# Altium schematic sheet AFE.SchDoc
size A; SheetNumber: 7; SheetTotal: 12
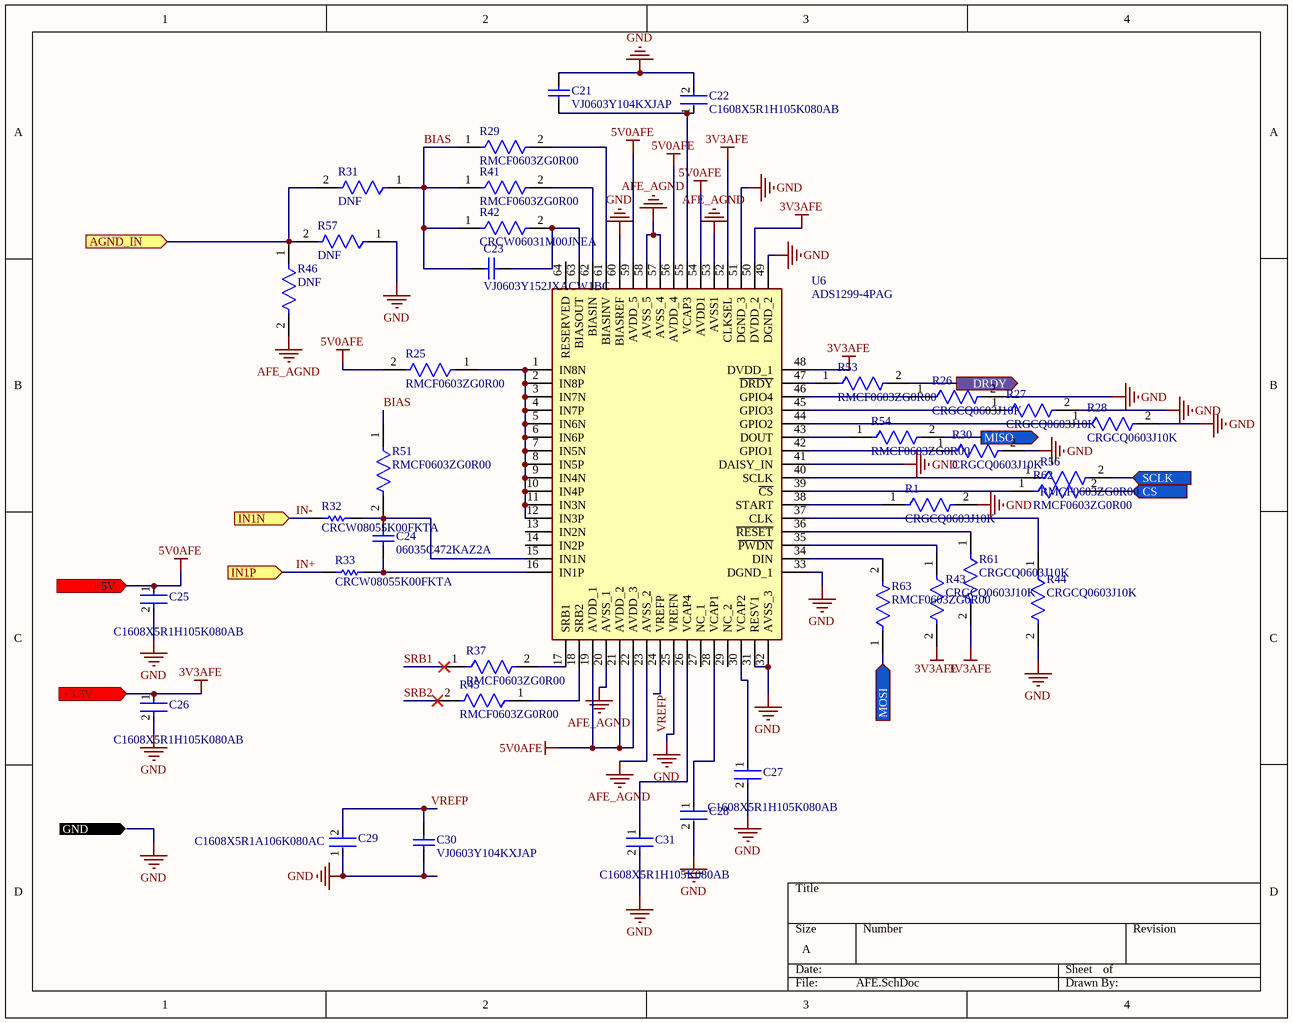
[diagram p0: AFE.SchDoc]

## Parts
C21  VJ0603Y104KXJAP  [CAPC1608X92X38NL15T08]
C22  C1608X5R1H105K080AB  [FP-C1608-080-0_1-IPC_B]
C23  VJ0603Y152JXACW1BC  [CAPC1608X95X40NL15T15]
C24  06035C472KAZ2A  [CAPC1608X90X35LL15T15]
C25  C1608X5R1H105K080AB  [FP-C1608-080-0_1-IPC_B]
C26  C1608X5R1H105K080AB  [FP-C1608-080-0_1-IPC_B]
C27  C1608X5R1H105K080AB  [FP-C1608-080-0_1-IPC_B]
C28  GRM21BR60J107ME15K  [FP-GRM21B-0_2-e0_2_0_7-IPC_B]  (value not drawn)
C29  C1608X5R1A106K080AC  [FP-C1608-080-0_1-MFG]
C30  VJ0603Y104KXJAP  [CAPC1608X92X38NL15T08]
C31  C1608X5R1H105K080AB  [FP-C1608-080-0_1-IPC_B]
R1  CRGCQ0603J10K  [FP-CRGCQ0603-IPC_C]
R25  RMCF0603ZG0R00  [FP-RMCF0603-IPC_B]
R26  CRGCQ0603J10K  [FP-CRGCQ0603-IPC_C]
R27  CRGCQ0603J10K  [FP-CRGCQ0603-IPC_C]
R28  CRGCQ0603J10K  [FP-CRGCQ0603-IPC_C]
R29  RMCF0603ZG0R00  [FP-RMCF0603-IPC_B]
R30  CRGCQ0603J10K  [FP-CRGCQ0603-IPC_C]
R31  DNF  [FP-RMCF0603-IPC_B]
R32  CRCW08055K00FKTA  [RESC2013X50X30ML20T20]
R33  CRCW08055K00FKTA  [RESC2013X50X30ML20T20]
R37  RMCF0603ZG0R00  [FP-RMCF0603-IPC_B]
R41  RMCF0603ZG0R00  [FP-RMCF0603-IPC_B]
R42  CRCW06031M00JNEA  [FP-CRCW0603-e3-IPC_B]
R43  CRGCQ0603J10K  [FP-CRGCQ0603-IPC_C]
R44  CRGCQ0603J10K  [FP-CRGCQ0603-IPC_C]
R45  RMCF0603ZG0R00  [FP-RMCF0603-IPC_B]
R46  DNF  [FP-RMCF0603-IPC_B]
R51  RMCF0603ZG0R00  [FP-RMCF0603-IPC_B]
R53  RMCF0603ZG0R00  [FP-RMCF0603-IPC_B]
R54  RMCF0603ZG0R00  [FP-RMCF0603-IPC_B]
R56  RMCF0603ZG0R00  [FP-RMCF0603-IPC_B]
R57  DNF  [FP-RMCF0603-IPC_B]
R61  CRGCQ0603J10K  [FP-CRGCQ0603-IPC_C]
R62  RMCF0603ZG0R00  [FP-RMCF0603-IPC_B]
R63  RMCF0603ZG0R00  [FP-RMCF0603-IPC_B]
U6  ADS1299-4PAG  [QFP50P1200X1200X120-64N]

## Ports
+3.3V (in), +5V (in), AGND_IN (in), CS (in), DRDY (out), GND (in), IN1N (in), IN1P (in), MISO (out), MOSI (in), SCLK (in)

## Nets
3V3AFE: C26.1 R43.2 R61.2 U6.48(DVDD_1) U6.50(DVDD_2) U6.52(CLKSEL) ; port +3.3V
5V0AFE: C25.1 R25.2 U6.19(AVDD_1) U6.21(AVDD_2) U6.22(AVDD_3) U6.54(AVDD1) U6.56(AVDD_4) U6.59(AVDD_5) ; port +5V
AFE_AGND: R46.2 U6.20(AVSS_1) U6.23(AVSS_2) U6.53(AVSS1) U6.57(AVSS_4) U6.58(AVSS_5)
GND: C21.2 C22.2 C25.2 C26.2 C27.2 C28.2 C29.1 C30.1 C31.2 R1.2 R26.2 R27.2 R28.2 R30.2 R44.2 R57.1 U6.25(VREFN) U6.31(RESV1) U6.32(AVSS_3) U6.33(DGND_1) U6.41(DAISY_IN) U6.49(DGND_2) U6.51(DGND_3) U6.60(BIASREF) ; port GND
AGND_IN: R31.2 R46.1 R57.2 ; port AGND_IN
BIAS: C23.1 R29.1 R31.1 R41.1 R42.1 R51.1
CS: R62.2 ; port CS
DRDY: R53.2 ; port DRDY
IN+: R33.1 ; port IN1P
IN-: R32.1 ; port IN1N
MISO: R54.2 ; port MISO
MOSI: R63.1 ; port MOSI
SCLK: R56.2 ; port SCLK
SRB1: R37.1
SRB2: R45.2
VREFP: C29.2 C30.2 U6.24(VREFP)
NetC21_1: C21.1 C22.1 U6.55(VCAP3)
NetC23_2: C23.2 R42.2 U6.63(BIASOUT)
NetC24_1: C24.1 R32.2 R51.2 U6.15(IN1N)
NetC24_2: C24.2 R33.2 U6.16(IN1P)
NetC27_1: C27.1 U6.30(VCAP2)
NetC28_1: C28.1 U6.28(VCAP1)
NetC31_1: C31.1 U6.26(VCAP4)
NetR1_1: R1.1 U6.38(START)
NetR25_1: R25.1 U6.1(IN8N) U6.2(IN8P) U6.3(IN7N) U6.4(IN7P) U6.5(IN6N) U6.6(IN6P) U6.7(IN5N) U6.8(IN5P) U6.9(IN4N) U6.10(IN4P) U6.11(IN3N) U6.12(IN3P)
NetR26_1: R26.1 U6.46(GPIO4)
NetR27_1: R27.1 U6.45(GPIO3)
NetR28_1: R28.1 U6.44(GPIO2)
NetR29_2: R29.2 U6.61(BIASINV)
NetR30_1: R30.1 U6.42(GPIO1)
NetR37_2: R37.2 U6.17(SRB1)
NetR41_2: R41.2 U6.62(BIASIN)
NetR43_1: R43.1 U6.35(~{PWDN})
NetR44_1: R44.1 U6.37(CLK)
NetR45_1: R45.1 U6.18(SRB2)
NetR53_1: R53.1 U6.47(~{DRDY})
NetR54_1: R54.1 U6.43(DOUT)
NetR56_1: R56.1 U6.40(SCLK)
NetR61_1: R61.1 U6.36(~{RESET})
NetR62_1: R62.1 U6.39(~{CS})
NetR63_2: R63.2 U6.34(DIN)

Not connected (* = marked no-connect by the designer): U6 13(IN2N) 14(IN2P) 27(NC_1) 29(NC_2) 64(RESERVED)

## Library data of the parts
C21 C30 = CMP-2006-01211-1: Manufacturer: Vitramon; Part Number: VJ0603Y104KXJAP
C22 C25-C27 C31 = CMP-2000-06025-2: Multilayer Ceramic Capacitors 1μF ±10% 50V X5R SMD 0603; Capacitance: 1uF; Lead Free: Lead Free; Height: 0.8mm; Mount: Surface Mount; Radiation Hardening: No; Thickness: 0.035inch; Length: 1.6mm; Max Operating Temperature: 85°C; REACH SVHC: No SVHC; Min Operating Temperature: -55°C; Construction: Flat; RoHS Compliant: Yes; Voltage Rating: 50V; Dielectric: X5R; Packaging: Tape and Reel; Termination: SMD/SMT; Voltage Rating (DC): 50V; Case Code (Imperial): 0603; Voltage: 50V; Width: 0.031inch; Weight: 7.1E-05oz; Depth: 0.8mm; Case Code (Metric): 1608; Series: C; Case/Package: 0603; Tolerance: 10%; Resistor Type: Ceramic; Number of Pins: 2; Dielectric Material: Ceramic; Package Quantity: 1
C23 = CMP-2006-01561-1: Manufacturer: Vitramon; Part Number: VJ0603Y152JXACW1BC
C24 = CMP-2006-04440-1: Manufacturer: AVX Interconnect / Elco; Part Number: 06035C472KAZ2A
C28 = CMP-06035-052658-1: Chip Multilayer Ceramic Capacitors for General Purpose, 0805, 100uF, X5R, 15%, 20%, 6.3V; Voltage Rating (DC): 6.3V; Lead Free: Lead Free; Length: 2mm; Tolerance: 20%; Width: 1.25mm; Capacitance: 100uF; Dielectric: X5R; Thickness: 1.25mm
C29 = CMP-2000-04979-3: Multilayer Ceramic Capacitors 10μF ±10% 10V X5R SMD 0603; Capacitance: 10uF; Dielectric Material: Ceramic; Construction: Flat; Height: 0.8mm; Thickness: 0.035inch; Case Code (Metric): 1608; Radiation Hardening: No; Number of Pins: 2; Voltage Rating (DC): 10V; Depth: 0.8mm; Voltage: 10V; RoHS Compliant: Yes; Voltage Rating: 10V; Package Quantity: 1; Resistor Type: Ceramic; Termination: SMD/SMT; Lead Free: Lead Free; REACH SVHC: No SVHC; Tolerance: 10%; Mount: Surface Mount; Series: C; Packaging: Tape and Reel; Width: 0.8mm; Dielectric: X5R; Weight: 7.1E-05oz; Length: 1.6mm; Max Operating Temperature: 85°C; Case Code (Imperial): 0603; Case/Package: 0603; Min Operating Temperature: -55°C
R1 R26-R28 R30 R43 R44 R61 = CMP-03211-009884-1: CRGCQ 0603 10K 5%; Manufacturer: TE Connectivity; Tolerance: 0.05; Power Rating: 0.1W; Resistance: 10KΩ; Voltage Rating: 75V; Value: 10KΩ; Temperature Coefficient: ±100ppm/°C; Composition: Thick Film; ComponentLink2URL: https://www.te.com/commerce/DocumentDelivery/DDEController?Action=showdoc&DocId=Data+Sheet%7F1773204-3%7F1%7Fpdf%7FEnglish%7FENG_DS_1773204-3_1.pdf%7F4-2176339-923; Device Class L1: Passive Components; Package: CRGCQ0603; Mouser Description: Res Thick Film 0603 10K Ohm 5% 0.1W(1/10W) ±100ppm/C Pad SMD Automotive T/R; Temperature Range High: +155°C; Category: Res; Device Class L2: Resistors; Height: 0.55mm; RoHS: TRUE; Lead Free: Yes; Ipc Land Pattern Name: RESC16080X45; Temperature: -55°C to +155°C; Series: CRGCQ; Digikey Description: CRGCQ 0603 10K 5%; Octopart: https://octopart.com/crgcq0603j10k-te+connectivity-91018097; Device Class L3: Chip SMD Resistors; Ambient Temperature Range High: +70°C; ComponentLink2Description: Datasheet; Temperature Range Low: -55°C; Manufacturer Part Number: CRGCQ0603J10K
R25 R29 R31 R37 R41 R45 R46 R51 R53 R54 R56 R57 R62 R63 = CMP-26527-006412-1: 0Ω ±0 0.1W 0603 Thick Film Chip Resistor AEC-Q200 compliant; Max Power Dissipation: 100mW; Resistance: 0R; Width: 0.031inch; RoHS Compliant: Yes; Number of Terminations: 2; Case/Package: 0603; Contact Plating: Tin; Height: 0.022inch; Resistor Type: Thick Film; Mount: Surface Mount; Length: 0.061inch; Features: Automotive AEC-Q200; Series: RMCF; Max Operating Temperature: 155°C; Radiation Hardening: No; Min Operating Temperature: -55°C; Packaging: Tape and Reel
R32 R33 = CMP-2001-04239-1: Manufacturer: Vishay Dale; Part Number: CRCW08055K00FKTA
R42 = CMP-2000-03016-2: RES Thick Film, 1MΩ, 5%, 0.1W, 200ppm/°C, 0603; Max Power Dissipation: 100mW; Resistance: 1MR; Voltage Rating: 75V; Temperature Coefficient: 200ppm/°C; Military Standard: Not; Mount: Surface Mount; Package Quantity: 1; Number of Pins: 2; Power Rating: 100mW; Packaging: Tape and Reel; Length: 1.55mm; Width: 0.85mm; Height: 0.02inch; Min Operating Temperature: -55°C; Tolerance: 5%; Depth: 0.85mm; Composition: Thick Film; Number of Terminations: 2; Max Operating Temperature: 155°C; Termination: SMD/SMT; Case Code (Imperial): 0603; Weight: 7.1E-05oz; Case Code (Metric): 1608; Radiation Hardening: No; Contact Plating: Tin; Case/Package: 0603; Features: Automotive AEC-Q200
U6 = ADS1299-4PAG: Low-Noise, 4-Channel, 24-Bit Analog-to-Digital Converter for Biopotential Measurements; Manufacturer_Name: Texas Instruments; Geometry.Height: 1.2mm; Mouser Part Number: 595-ADS1299-4PAG; Mouser Price/Stock: https://www.mouser.co.uk/ProductDetail/Texas-Instruments/ADS1299-4PAG?qs=9lcNTSmDlCovTG3JfbaYgg%3D%3D; Manufacturer_Part_Number: ADS1299-4PAG; Datasheet Link: http://www.ti.com/lit/gpn/ads1299-4